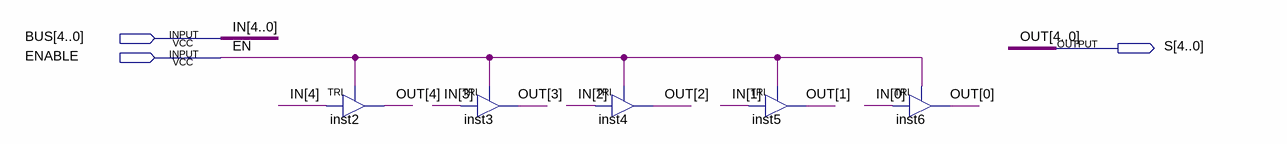
[diagram p0: schematic sheet]
// Quartus schematic Tristate5bits.bdf as structural Verilog: 5 symbols, 3 pins
module Tristate5bits (
  input  [4:0] BUS,
  input  ENABLE,
  output [4:0] S
);

  TRI inst2 (.IN(BUS[4]), .OE(ENABLE), .OUT(S[4]));
  TRI inst3 (.IN(BUS[3]), .OE(ENABLE), .OUT(S[3]));
  TRI inst4 (.IN(BUS[2]), .OE(ENABLE), .OUT(S[2]));
  TRI inst5 (.IN(BUS[1]), .OE(ENABLE), .OUT(S[1]));
  TRI inst6 (.IN(BUS[0]), .OE(ENABLE), .OUT(S[0]));

  // Other names for the same wires on the sheet: EN = ENABLE; IN[4:0] = BUS; OUT[4:0] = S
endmodule
